# EAGLE design easyMySens-v030 (EAGLE 7.3.0)
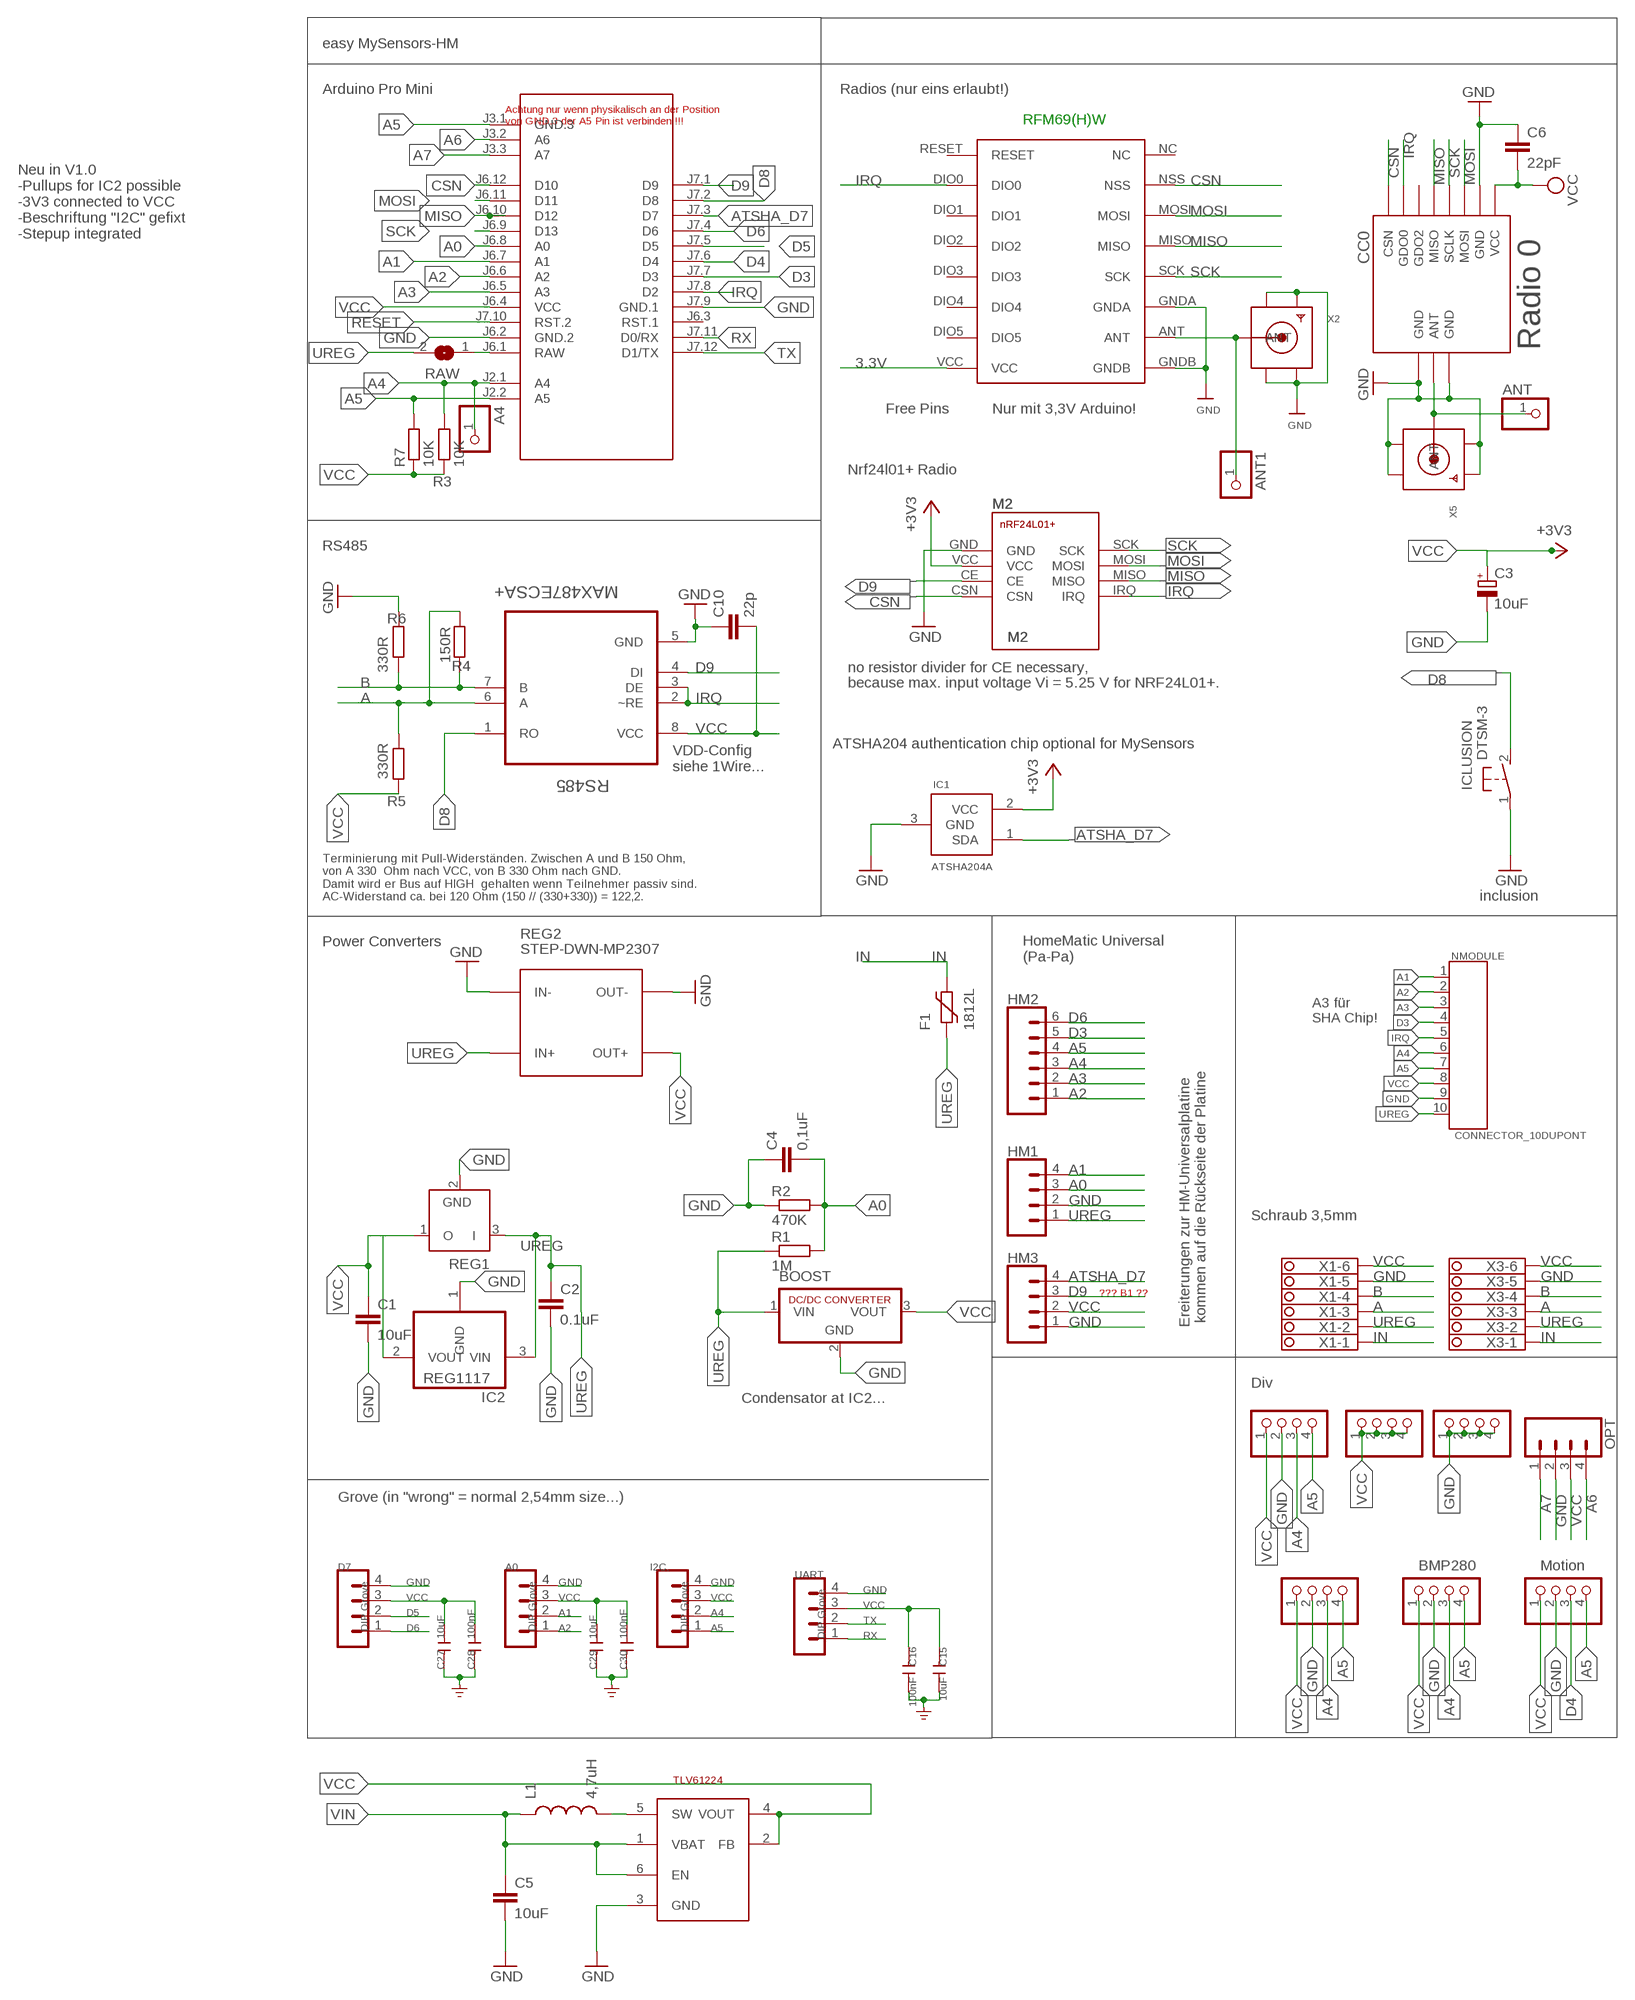
[diagram p0: schematic, sheet 1]

## Parts
A0  DIP Grove  MA04-1  [MA04-1]
A4  PINHD-1X1  [1X01]
ANT  PINHD-1X1  [1X01]
ANT1  PINHD-1X1  [1X01]
BH1750  PINHD-1X04_2.54-S  [1X04-S]
BOOST  R-78C1.8-1.0  [SIP3]
C1  10uF  C-EUC1210  [C1210]
C2  0.1uF  C-EUC1206  [C1206]
C3  10uF  CPOL-EUSMCC  [SMC_C]
C4  0,1uF  C-EUC1206  [C1206]
C5  10uF  CAP0805  [0805]
C6  22pF  C-EUC0805  [C0805]
C10  22p  C-EUC0805  [C0805]
C15  10uF  CAP-0603  [C0603]
C16  100nF  CAP-0603  [C0603]
C27  10uF  CAP-0603  [C0603]
C28  100nF  CAP-0603  [C0603]
C29  10uF  CAP-0603  [C0603]
C30  100nF  CAP-0603  [C0603]
CC0  CC1101  CC1101_MODULE1SMD  [CC1101_MODULE1_SMD]
D7  DIP Grove  MA04-1  [MA04-1]
F1  1812L  [1812L]
HM1  CONN_04  [1X04]
HM2  CONN_06SILK_FEMALE_PTH  [1X06]
HM3  CONN_04  [1X04]
I2C-1  PINHD-1X04_2.54-S  [1X04-S]
I2C-2  PINHD-1X04_2.54-S  [1X04-S]
I2C.  DIP Grove  MA04-1  [MA04-1]
IC1  ATSHA204A  [SOT23]
IC2  REG1117  [SOT223]
ICLUSION  DTSM-3  [DTSM-3]
JP1  PINHD-1X04_2.54-S  [1X04-S]
JP3  PINHD-1X04_2.54-S  [1X04-S]
L1  4,7uH  INDUCTOR0805  [0805]
M1  ARDUINO-PRO-MINI-3.3V#NP  [ARDUINO-PRO-MINI#NP]
M2  NRF24L01+SMD  [NRF24L01+SMD]
MOTION  PINHD-1X04_2.54-S  [1X04-S]
NMODULE  CONNECTOR_10DUPONT  [DUPONT_10]
OPT  CONN_04  [1X04]
R1  1M  R-EU_R0805  [R0805]
R2  470K  R-EU_R0805  [R0805]
R3  10K  R-EU_R0805  [R0805]
R4  150R  R-EU_R0805  [R0805]
R5  330R  R-EU_R0805  [R0805]
R6  330R  R-EU_R0805  [R0805]
R7  10K  R-EU_R0805  [R0805]
RAW  SJ  [SJ]
REG1  LP2950Z  [TO92]
REG2  STEP-DWN-MP2307  DC-DC-STEP-DOWN-MP2307  [DC-DC-STEP-DOWN-MP2307]
RFM69W  RFM69HW  [RFM]
RS485  MAX487ECSA+  [SOIC127P600X175-8N]
STEPUP  TLV61224  TI-TLV61224  [SOT23-6L]
UART  DIP Grove  MA04-1  [MA04-1]
X1  1751280  [1751280]
X2  SMACONNECTOR_EDGE  [SMA_EDGELAUNCH]
X3  1751280  [1751280]
X5  SMACONNECTOR_EDGE  [SMA_EDGELAUNCH]

## Nets
3.3V [Power]: IC1.2(VCC) M2.VCC RFM69W.VCC ; supply symbol labelled +3V3
A: R4.1 R5.2 RS485.6(A) X1.3 X3.3
A0: C4.2 HM1.3 M1.J6.8(A0) R1.2 R2.2
A1: A0.2 HM1.4 M1.J6.7(A1) NMODULE.1
A2: A0.1 HM2.1 M1.J6.6(A2) NMODULE.2
A3: HM2.2 M1.J6.5(A3) NMODULE.3
A4: A4.1 BH1750.3 HM2.3 I2C-1.3 I2C-2.3 I2C..2 M1.J2.1(A4) NMODULE.6 R3.2
A5: BH1750.4 HM2.4 I2C-1.4 I2C-2.4 I2C..1 M1.J2.2(A5) M1.J3.1(GND.3) MOTION.4 NMODULE.7 R7.2
A6: M1.J3.2(A6) OPT.4
A7: M1.J3.3(A7) OPT.1
ANT0: ANT.1 CC0.ANT X5.P(ANT)
ATSHA_D7: HM3.4 IC1.1(SDA) M1.J7.3(D7)
B: R4.2 R6.1 RS485.7(B) X1.4 X3.4
CSN: CC0.CSN M1.J6.12(D10) M2.CSN RFM69W.NSS
D3: HM2.5 M1.J7.7(D3) NMODULE.4
D4: M1.J7.6(D4) MOTION.3
D5: D7.2 M1.J7.5(D5)
D6: D7.1 HM2.6 M1.J7.4(D6)
D8: ICLUSION.2 M1.J7.2(D8) RS485.1(RO)
D9: HM3.3 M1.J7.1(D9) M2.CE RS485.4(DI)
GND [Power]: A0.4 BH1750.2 BOOST.2(GND) C1.2 C2.2 C3.- C4.1 C5.2 C6.1 C10.1 C15.1 C16.1 C27.2 C28.2 C29.2 C30.2 CC0.GND@0(GND) CC0.GND@1(GND) CC0.GND@2(GND) D7.4 HM1.2 HM3.1 I2C-1.2 I2C-2.2 I2C..4 IC1.3(GND) IC2.1(GND) ICLUSION.1 JP1.1 JP1.2 JP1.3 JP1.4 M1.J6.2(GND.2) M1.J7.9(GND.1) M2.GND MOTION.2 NMODULE.9 OPT.2 R2.1 R6.2 REG1.2(GND) REG2.IN- REG2.OUT- RFM69W.GNDA RFM69W.GNDB RS485.5(GND) STEPUP.3(GND) UART.4 X1.5 X2.GND@1(GND4) X2.GND@2(GND3) X2.GND@3(GND2) X2.GND@4(GND1) X3.5 X5.GND@1(GND4) X5.GND@2(GND3) X5.GND@3(GND2) X5.GND@4(GND1) ; supply symbol labelled GND_POWER
IN [Power]: F1.P$2 X1.1 X3.1
IRQ: CC0.GDO0 M1.J7.8(D2) M2.IRQ NMODULE.5 RFM69W.DIO0 RS485.2(~RE) RS485.3(DE)
MISO: CC0.MISO M1.J6.10(D12) M2.MISO RFM69W.MISO
MOSI: CC0.MOSI M1.J6.11(D11) M2.MOSI RFM69W.MOSI
N$13: L1.2 STEPUP.5(SW)
N$16: ANT1.1 RFM69W.ANT X2.P(ANT)
RAW [Power]: M1.J6.1(RAW) RAW.1
RESET: M1.J7.10(RST.2)
RX: M1.J7.11(D0/RX) UART.1
SCK: CC0.SCLK M1.J6.9(D13) M2.SCK RFM69W.SCK
TX: M1.J7.12(D1/TX) UART.2
UREG [Power]: BOOST.1(VIN) C2.1 F1.P$1 HM1.1 IC2.3(VIN) NMODULE.10 R1.1 RAW.2 REG1.3(I) REG2.IN+ X1.2 X3.2
VCC [Power]: A0.3 BH1750.1 BOOST.3(VOUT) C1.1 C3.+ C6.2 C10.2 C15.2 C16.2 C27.1 C28.1 C29.1 C30.1 CC0.VCC D7.3 HM3.2 I2C-1.1 I2C-2.1 I2C..3 IC2.2(VOUT) JP3.1 JP3.2 JP3.3 JP3.4 M1.J6.4(VCC) MOTION.1 NMODULE.8 OPT.3 R3.1 R5.1 R7.1 REG1.1(O) REG2.OUT+ RS485.8(VCC) STEPUP.2(FB) STEPUP.4(VOUT) UART.3 X1.6 X3.6 ; supply symbol labelled +3V3
VIN: C5.1 L1.1 STEPUP.1(VBAT) STEPUP.6(EN)
Unconnected: CC0.GDO2 M1.J6.3(RST.1) RFM69W.DIO1 RFM69W.DIO2 RFM69W.DIO3 RFM69W.DIO4 RFM69W.DIO5 RFM69W.NC RFM69W.RESET

## Notes on the sheet
- easy MySensors-HM
- Arduino Pro Mini | Radios (nur eins erlaubt!)
- Achtung nur wenn physikalisch an der Position 
  von GND.3 der A5 Pin ist verbinden !!!
- RFM69(H)W
- Neu in V1.0
  -Pullups for IC2 possible
  -3V3 connected to VCC
  -Beschriftung "I2C" gefixt
  -Stepup integrated
- Radio 0
- Free Pins | Nur mit 3,3V Arduino!
- Nrf24l01+ Radio
- RS485
- no resistor divider for CE necessary,
- because max. input voltage Vi = 5.25 V for NRF24L01+.
- ATSHA204 authentication chip optional for MySensors
- VDD-Config
  siehe 1Wire...
- Terminierung mit Pull-Widerständen. Zwischen A und B 150 Ohm,
  von A 330  Ohm nach VCC, von B 330 Ohm nach GND. 
  Damit wird er Bus auf HIGH  gehalten wenn Teilnehmer passiv sind.
  AC-Widerstand ca. bei 120 Ohm (150 // (330+330)) = 122,2.
- inclusion
- Power Converters
- HomeMatic Universal
  (Pa-Pa)
- A3 für 
  SHA Chip!
- Schraub 3,5mm
- ??? B1 ??
- Ereiterungen zur HM-Universalplatine
   kommen auf die Rückseite der Platine
- Div
- Condensator at IC2...
- Grove (in "wrong" = normal 2,54mm size...)
- BMP280 | Motion

## Library data of the parts
A0 D7 I2C. UART = con-lstb:MA04-1: PIN HEADER; OC_FARNELL: unknown; OC_NEWARK: unknown
A4 ANT ANT1 = pinhead:PINHD-1X1: PIN HEADER
BH1750 I2C-1 I2C-2 JP1 JP3 MOTION = pinhead-2:PINHD-1X04: PIN HEADER
BOOST = dc-dc-converter:R-78C*-1.0: INNOLINE DC/DC-Converter 1.0 AMP SIP3 Single Output Source: Data sheet <http://www.mikrocontroller.net/attachment/150645/157764-da-01-en-DC_DC_WANDLER_R_78C5_0_1_0.pdf>
C1 C2 C4 C6 C10 = rcl:C-EU: CAPACITOR, European symbol
C3 = rcl:CPOL-EU: POLARIZED CAPACITOR, European symbol
C5 = SparkFun-Passives:CAP: Capacitor Standard 0603 ceramic capacitor, and 0.1" leaded capacitor.
C15 C16 C27-C30 = Discrete-new:CAP: Ceramic Capacitors
CC0 = wireless:CC1101_MODULE1: CC1101 wireless module for 433/868 MHz (sold from Aliexpress). DIL version for mounting with pin header (and SMD soldering) and SMD only variant available.
F1 = ptc-littlefuse:1812L
HM1 HM3 OPT = SparkFun-Connectors:CONN_04: Multi connection point. Often used as Generic Header-pin footprint for 0.1 inch spaced/style header connections On any of the 0.1 inch spaced packages, you can populate with these: Break Away Headers - Straight <https://www.sparkfun.com/products/116> (PRT-00116) Break Away Male Headers - Right Angle <https://www.sparkfun.com/products/553> (PRT-00553) Female Headers <https://www.sparkfun.com/products/115> (PRT-00115) Break Away Headers - Machine Pin <https://www.sparkfun.com/products/117> (PRT-00117) Break Away Female Headers - Swiss Machine Pin <https://www.sparkfun.com/products/743> (PRT-00743) For SCREWTERMINALS and SPRING TERMINALS visit here: Screw Terimnals on SparkFun.com <https://www.sparkfun.com/search/results?term=Screw+Terminals> (5mm/3.5mm/2.54mm spacing) This device is also useful as a general connection point to wire up your design to another part of your project. Our various solder wires solder well into these plated through hole pads. Hook-Up Wire - Assortment (Stranded, 22 AWG) <https://www.sparkfun.com/products/11375> (PRT-11375) Hook-Up Wire - Assortment (Solid Core, 22 AWG) <https://www.sparkfun.com/products/11367> (PRT-11367) View the entire wire category on our website here <https://www.sparkfun.com/categories/141> Special notes: Molex polarized connector foot print use with SKU : PRT-08231 with associated crimp pins and housings. 1MM SMD Version SKU: PRT-10208; PROD_ID: CONN-09696
HM2 = SparkFun-Connectors:CONN_06: Multi connection point. Often used as Generic Header-pin footprint for 0.1 inch spaced/style header connections On any of the 0.1 inch spaced packages, you can populate with these: Break Away Headers - Straight <https://www.sparkfun.com/products/116> (PRT-00116) Break Away Male Headers - Right Angle <https://www.sparkfun.com/products/553> (PRT-00553) Female Headers <https://www.sparkfun.com/products/115> (PRT-00115) Break Away Headers - Machine Pin <https://www.sparkfun.com/products/117> (PRT-00117) Break Away Female Headers - Swiss Machine Pin <https://www.sparkfun.com/products/743> (PRT-00743) Arduino Stackable Header - 6 Pin <https://www.sparkfun.com/products/9280> (PRT-09280) For SCREWTERMINALS and SPRING TERMINALS visit here: Screw Terimnals on SparkFun.com <https://www.sparkfun.com/search/results?term=Screw+Terminals> (5mm/3.5mm/2.54mm spacing) This device is also useful as a general connection point to wire up your design to another part of your project. Our various solder wires solder well into these plated through hole pads. Hook-Up Wire - Assortment (Stranded, 22 AWG) <https://www.sparkfun.com/products/11375> (PRT-11375) Hook-Up Wire - Assortment (Solid Core, 22 AWG) <https://www.sparkfun.com/products/11367> (PRT-11367) View the entire wire category on our website here <https://www.sparkfun.com/categories/141>; PROD_ID: CONN-08437
IC1 = Sensor:ATSHA204A
IC2 = burr-brown:REG1117: 800mA and 1A Low Dropout (LDO) Positive Regulator 1.8V, 2.5V, 2.85V, 3.3V, 5V, and Adj; MPN: REG1117; OC_FARNELL: 1097566; OC_NEWARK: 14P6981
ICLUSION = mechanics:DTSM-3: Diptronics SMD button 6x3.5 mm
L1 = SparkFun-Passives:INDUCTOR: Inductors Basic Inductor/Choke - 0603 and 1206. Footprints are not proven and vary greatly between part numbers.
M1 = diy-modules:ARDUINO-PRO-MINI-*#NP: Arduino Pro Mini without programming pads
M2 = wireless:NRF24L01+: nRF24L01+ Transceiver Module
NMODULE = TD-MySensors:CONNECTOR_10
R1-R7 = rcl:R-EU_: RESISTOR, European symbol
RAW = jumper:SJ: SMD solder JUMPER
REG1 = linear:LP2950: 100 mA, Low Power Low Dropout Voltage Regulator Source: http://www.onsemi.com/pub/Collateral/LP2950-D.PDF
REG2 = diy-modules:DC-DC-STEP-DOWN-MP2307: DC/DC Step-Down Regulator based on MP2307DN chip MP2307 datasheet available here: https://cdn-shop.adafruit.com/datasheets/MP2307_r1.9.pdf Click here to find device on ebay.com <http://www.ebay.com/sch/dc+dc+3a+mini+converter>
RFM69W = hoperf:RFM69HW
RS485 = Maxim_By_element14_Batch_1:MAX487ECSA+: Low-Power, Slew-Rate-Limited RS-485/RS-422 Transceivers; MPN: MAX487ECSA+; OC_FARNELL: 9724532; OC_NEWARK: 68K4803; PACKAGE: SOIC-8; SUPPLIER: Maxim
STEPUP = TLV61224:TI-TLV61224
X1 X3 = con-phoenix-350:1751280: MKDS 1/ 6-3,5 Printklemme Nennstrom: 10 A Bemessungsspannung: 160 V Raster: 3,5 mm Polzahl: 6 Montageart: Löten Anschlussart: Schraubanschluss Anschlussrichtung vom Leiter zur Platine: 0° Source: http://eshop.phoenixcontact.com .. 1751280.pdf; MPN: 1751280; OC_FARNELL: unknown; OC_NEWARK: 27R1765
X2 X5 = adafruit:SMACONNECTOR: SMA Connector 90° DIP SMA Connector, 50 Ohm (4UConnector: 07259)

## Net classes
0 default: width 0.305 mm
1 Power: width 0.508 mm

## Board
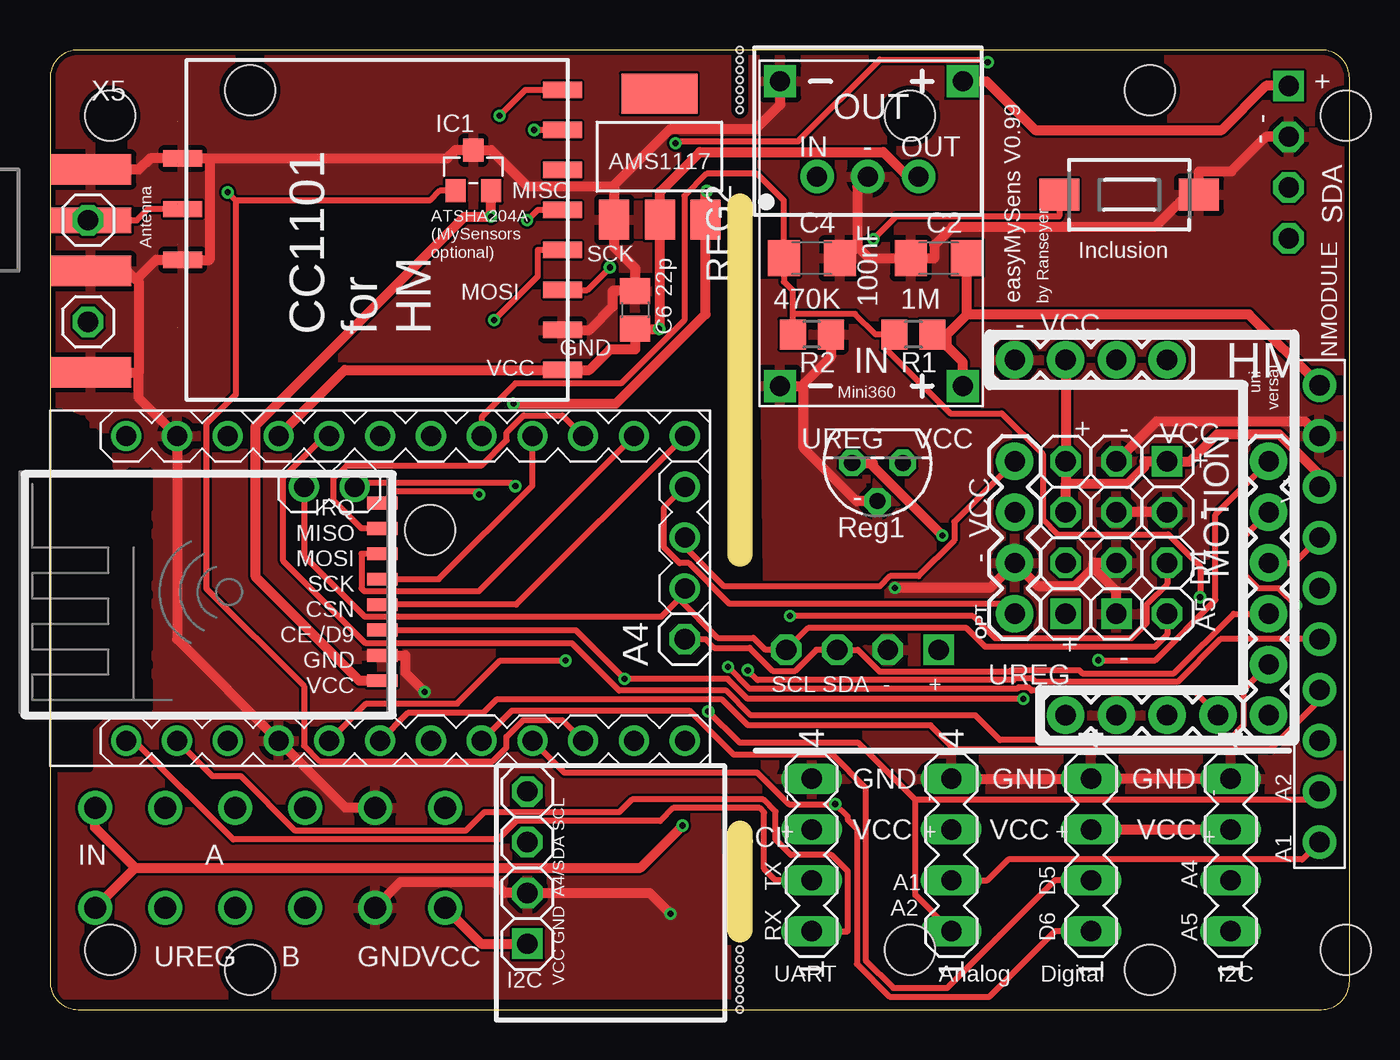
[diagram p1: board, top side]
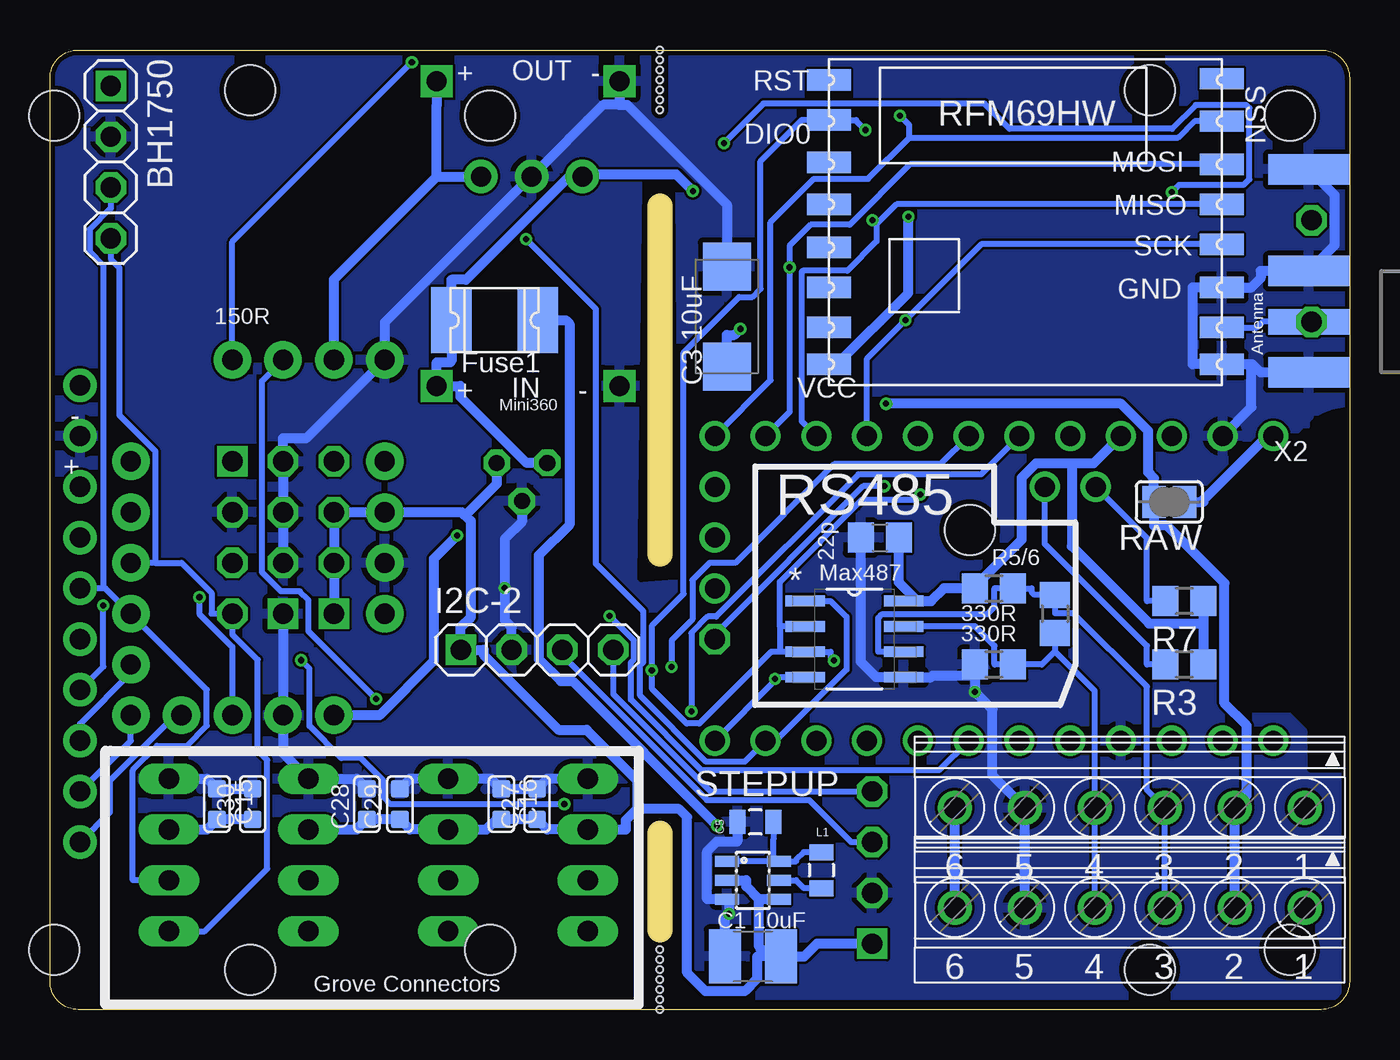
[diagram p2: board, bottom side, seen from below]

Size 65 x 48 mm. Coordinates in mm from the lower left corner, seen from the top.
Outline: 0,46.59 0,1.41 arc90 1.41,0 63.59,0 arc90 65,1.41 65,46.59 arc90 63.59,48 1.41,48 arc90 0,46.59
Copper layers (1*16): Top 0.035mm / dielectric 1.5mm / Bottom 0.035mm
Design rules "dirt_cheap_dirty_boards.v1": minimum track width 5mil, minimum drill 12mil, track to track 5mil, track to pad 5mil, pad to pad 5mil, via to via 5mil, smd to smd 0mil, copper to edge 10mil, drill to drill 10mil, minimum pad ring 10mil, minimum via ring 6mil, stop-mask expansion 2mil, vias tented up to drill 25mil, thermal gap 10mil
Holes 2.5 mm at 19,24 3,3 3,44.7 64.8,44.7 43,3 64.8,3 43,44.7 10,2 55,2 10,46 55,46
Holes 0.3 mm at 34.5,3 34.5,2.5 34.5,2 34.5,1.5 34.5,1 34.5,0.5 34.5,45 34.5,45.5 34.5,46 34.5,46.5 34.5,47 34.5,47.5 34.5,48 34.5,0
tRestrict: area 33.8,21.6 to 35.4,41.4; area 33.8,3.3 to 35.3,9.6; 18 lines
bRestrict: area 33.8,21.6 to 35.4,41.3; area 33.8,3.3 to 35.4,9.5; 17 lines
Milling: 2 lines

### Footprints (pad centres in the part's own frame; a part is rotated, then mirrored left to right if it is on the bottom)
MA04-1 = drill 1.016 long: 1 -3.81,0; 2 -1.27,0; 3 1.27,0; 4 3.81,0
1X01 = drill 1.016 octagon: 1 0,0
1X04-S = drill 1.016 square: 1 -3.81,0 | drill 1.016 octagon: 2 -1.27,0; 3 1.27,0; 4 3.81,0
SIP3 = drill 1 pad 1.676: 1 -2.54,0; 2 0,0; 3 2.54,0
C1210 = smd 1.6 x 2.7: 1 -1.4,0; 2 1.4,0
C1206 = smd 1.6 x 1.8: 1 -1.4,0; 2 1.4,0
SMC_C = smd 2.4 x 2.4: + -2.5,0; - 2.5,0
0805 = smd 0.8 x 1.2: 1 -0.9,0; 2 0.9,0
C0805 = smd 1.3 x 1.5: 1 -0.95,0; 2 0.95,0
C0603 = smd 0.889 x 0.889: 1 0,0.762; 2 0,-0.762
CC1101_MODULE1_SMD = smd 1.93 x 0.813: ANT 19,5.96; CSN 0,0; GDO0 0,2; GDO2 0,4; GND@0 0,12; GND@1 19,8.5; GND@2 19,3.42; MISO 0,6; MOSI 0,10; SCLK 0,8; VCC 0,14
1812L = smd 2.03 x 3.3: P$1 -2.16,0; P$2 2.16,0
1X04 = drill 1.016 pad 1.88: 1 0,0; 2 2.54,0; 3 5.08,0; 4 7.62,0
1X06 = drill 1.016 pad 1.88: 1 0,0; 2 2.54,0; 3 5.08,0; 4 7.62,0; 5 10.16,0; 6 12.7,0
SOT23 = smd 1.016 x 1.143: 1 -0.889,-1.016; 2 0.889,-1.016; 3 0,1.016
SOT223 = smd 1.499 x 2.007: 1 -2.261,-3.15; 2 0.025,-3.15; 3 2.311,-3.15 | smd 3.81 x 2.007: 4 0,3.15
DTSM-3 = smd 2 x 1.6: 1 -3.494,0; 2 3.494,0
ARDUINO-PRO-MINI#NP = drill 1: J2.1 -1.27,5.08; J2.2 -3.81,5.08; J3.1 15.24,0; J3.2 15.24,2.54; J3.3 15.24,5.08; J6.1 -12.7,7.62; J6.2 -10.16,7.62; J6.3 -7.62,7.62; J6.4 -5.08,7.62; J6.5 -2.54,7.62; J6.6 0,7.62; J6.7 2.54,7.62; J6.8 5.08,7.62; J6.9 7.62,7.62; J6.10 10.16,7.62; J6.11 12.7,7.62; J6.12 15.24,7.62; J7.1 15.24,-7.62; J7.2 12.7,-7.62; J7.3 10.16,-7.62; J7.4 7.62,-7.62; J7.5 5.08,-7.62; J7.6 2.54,-7.62; J7.7 0,-7.62; J7.8 -2.54,-7.62; J7.9 -5.08,-7.62; J7.10 -7.62,-7.62; J7.11 -10.16,-7.62; J7.12 -12.7,-7.62
NRF24L01+SMD = smd 0.635 x 1.524: CE -1.575,-7.861; CSN -0.305,-7.861; GND -2.845,-7.861; IRQ 4.775,-7.861; MISO 3.505,-7.861; MOSI 2.235,-7.861; SCK 0.965,-7.861; VCC -4.115,-7.861
DUPONT_10 = drill 1.016 pad 1.676: 1 1.27,1.27; 2 3.81,1.27; 3 6.35,1.27; 4 8.89,1.27; 5 11.43,1.27; 6 13.97,1.27; 7 16.51,1.27; 8 19.05,1.27; 9 21.59,1.27; 10 24.13,1.27
R0805 = smd 1.3 x 1.5: 1 -0.95,0; 2 0.95,0
SJ = smd 1.168 x 1.6: 1 -0.762,0; 2 0.762,0
TO92 = drill 0.813 octagon: 1 -1.27,0; 2 0,1.905; 3 1.27,0
DC-DC-STEP-DOWN-MP2307 = drill 1 pad 1.6 square: IN+ -7.62,-4.572; IN- -7.62,4.572; OUT+ 7.62,-4.572; OUT- 7.62,4.572
RFM = smd 2.184 x 1.067: ANT 19.651,2.889; DIO0 0,13.27; DIO1 0,11.143; DIO2 0,9.047; DIO3 0,6.889; DIO4 0,4.889; DIO5 0,2.889; GNDA 19.651,4.889; GNDB 19.651,1.048; MISO 19.651,9.047; MOSI 19.651,11.047; NC 19.651,15.334; NSS 19.651,13.206; RESET 0,15.27; SCK 19.651,7.048; VCC 0,1.048
SOIC127P600X175-8N = smd 1.981 x 0.533: 1 -2.464,1.905; 2 -2.464,0.635; 3 -2.464,-0.635; 4 -2.464,-1.905; 5 2.464,-1.905; 6 2.464,-0.635; 7 2.464,0.635; 8 2.464,1.905
SOT23-6L = smd 0.55 x 1.2: 1 -0.95,-1.3; 2 0,-1.3; 3 0.95,-1.3; 4 0.95,1.3; 5 0,1.3; 6 -0.95,1.3
1751280 = drill 1.1 pad 1.7: 1 -8.75,-0.1; 2 -5.25,-0.1; 3 -1.75,-0.1; 4 1.75,-0.1; 5 5.25,-0.1; 6 8.75,-0.1
SMA_EDGELAUNCH = smd 4.064 x 1.524: GND@1 2.032,-2.54; GND@2 2.032,2.54 | smd 4.064 x 1.524 bottom: GND@3 2.032,2.54; GND@4 2.032,-2.54 | smd 4.064 x 1.27: P 2.032,0

### Placement (x,y rotation side)
A0  45.09,7.73 90 top
A4  31.75,18.53 90 top
ANT  1.91,39.48 0 top
ANT1  1.91,34.41 0 top
BH1750  61.96,42.39 270 bottom
BOOST  40.91,41.67 0 top
C1  29.84,2.66 180 bottom
C2  44.45,37.58 180 top
C3  31.14,34.67 90 bottom
C4  38.1,37.58 180 top
C5  29.72,9.39 180 bottom
C6  29.27,35 270 top
C10  23.5,23.61 0 bottom
C15  56.64,10.27 0 bottom
C16  42.42,10.27 0 bottom
C27  40.64,10.27 180 bottom
C28  49.15,10.27 180 bottom
C29  47.5,10.27 180 bottom
C30  54.86,10.27 180 bottom
CC0  25.64,46 180 top
D7  52.07,7.73 90 top
F1  42.76,34.48 0 bottom
HM1  50.8,14.72 0 top
HM2  60.96,14.72 90 top
HM3  48.26,32.5 0 top
I2C-1  23.88,7.1 90 top
I2C-2  40.64,17.99 0 bottom
I2C.  59.05,7.73 90 top
IC1  21.18,41.97 0 top
IC2  30.48,42.66 0 top
ICLUSION  53.98,40.75 180 top
JP1  53.34,23.61 90 top
JP3  50.8,23.61 90 top
L1  26.42,6.97 270 bottom
M1  16.51,21.07 0 top
M2  8.76,20.56 90 top
MOTION  55.88,23.61 270 top
NMODULE  64.77,7.1 90 top
OPT  48.26,19.8 90 top
R1  43.18,33.77 180 top
R2  38.1,33.77 180 top
R3  8.26,17.26 180 bottom
R4  14.73,19.8 270 bottom
R5  17.78,21.07 0 bottom
R6  17.78,17.26 180 bottom
R7  8.26,20.44 180 bottom
RAW  9.02,25.39 180 bottom
REG1  41.39,27.34 180 top
REG2  41.09,38.81 90 top
RFM69W  26.04,31.23 0 bottom
RS485  24.77,18.53 0 bottom
STEPUP  29.84,6.47 270 bottom
UART  38.1,7.73 90 top
X1  11,10 180 bottom
X2  0,34.41 180 bottom
X3  11,5 180 bottom
X5  0,39.48 0 top

### Tracks (layer width: path | path; a pad name or v marks a point on that pad's centre or on a via)
3.3V  (via drill 0.3 pad 0.61)
  Top 0.508: M2.VCC 15.48,16.45 10.29,21.64 10.29,29.22 20.73,39.66 v22.06,39.66 IC1.2
  Bottom 0.508: RFM69W.VCC 25.63,32.28 22.06,35.84 v22.06,39.66
A
  Bottom 0.305: X3.3 X1.3 10.13,10.98 10.13,16.15 13.8,19.82 14.73,19.82 R4.1 15.76,20.75 15.9,20.89 15.9,21.07 R5.2 17.76,21.07 17.76,20.14 18.12,19.78 23.39,19.78 23.57,19.59 23.57,17.9 RS485.6
A0  (via drill 0.3 pad 0.61)
  Top 0.305: 41.77,33.77 41.77,33.09 45.03,29.82 47.61,29.82 49.65,27.78 49.65,24.53 50.42,23.76 55.93,23.76 57.53,22.17 v57.53,20.63 | 41.77,33.77 41.3,33.77 40.27,34.8 37.15,34.8 | R1.2 41.77,33.77 | 37.15,34.8 37.15,35.95 36.7,36.4 C4.2 36.7,40.47 35.36,41.8 32.84,41.8 31.73,40.69 31.73,34.49 28.56,31.31 23.28,31.31 21.59,29.63 M1.J6.8 | R2.2 37.15,34.8
  Bottom 0.305: v57.53,20.63 57.53,19.79 55.88,18.15 HM1.3
A1  (via drill 0.3 pad 0.61)
  Top 0.305: HM1.4 57.18,15.96 49.1,15.96 48.94,16.12 48.45,16.12 48.38,16.05 35,16.05 v33.91,17.13 | A0.2 46.89,6.47 47.93,7.51 62.64,7.51 NMODULE.1
  Bottom 0.305: NMODULE.1 61.99,9.88 61.99,11.47 58.74,14.72 HM1.4 | M1.J6.7 20.46,27.28 25.78,27.28 30.72,22.34 32.01,22.34 32.87,21.48 32.87,19.5 33.91,18.46 v33.91,17.13
A2  (via drill 0.3 pad 0.61)
  Top 0.305: v32.92,14.92 34.49,13.35 40.4,13.35 43.28,10.48 | NMODULE.2 63.07,10.48 43.28,10.48 | A0.1 43.28,5.73 43.28,10.48
  Bottom 0.305: M1.J6.6 18.43,26.77 24.57,26.77 31.69,19.65 32.1,19.65 32.92,18.83 v32.92,14.92 | NMODULE.2 60.96,13.45 HM2.1
A3
  Top 0.305: HM2.2 59.69,15.99 59.69,14.2 58.98,13.49 47.52,13.49 46.28,14.72 35.04,14.72 33.81,15.95 28.47,15.95 26.11,18.31 15.79,18.31 11.66,22.44 11.66,26.62 13.73,28.69 M1.J6.5
  Bottom 0.305: NMODULE.3 63.5,14.29 60.96,16.83 HM2.2
A4  (via drill 0.3 pad 0.61)
  Top 0.305: HM2.3 59.2,19.8 56.22,16.82 51.63,16.82 51.47,16.99 48.09,16.99 48.02,16.91 41.49,16.91 40.41,17.99 I2C-2.3 38.33,17.99 37.28,16.94 36.15,16.94 34.99,18.1 33.22,18.1 32.79,18.53 A4.1 | M1.J2.1 15.44,26.35 23.11,26.35 v23.28,26.18
  Bottom 0.305: v23.28,26.18 24.33,26.18 31.75,18.76 A4.1 | BH1750.3 61.96,40.08 63.02,39.02 63.02,37.93 62.33,37.24 62.33,21.07 | I2C..2 60.86,6.47 60.86,11.98 59.64,13.2 58.16,13.2 57.15,14.2 57.15,15.99 HM2.3 62.23,21.07 62.33,21.07 | R3.2 10.13,17.26 10.13,18.19 15.24,23.3 M1.J2.1 | I2C-1.3 24.92,8.37 27.03,10.48 32.14,10.48 39.37,17.71 I2C-2.3 | 62.33,21.07 NMODULE.6
A5
  Top 0.305: HM2.4 62.23,22.34 NMODULE.7 | 31.45,20.54 33.39,18.6 35.18,18.6 35.79,17.99 I2C-2.4 37.92,19.08 45.84,19.08 46.78,18.14 55.26,18.14 55.88,18.76 MOTION.4 | M1.J2.2 12.7,22.7 15.74,19.66 30.58,19.66 31.45,20.54 | 31.45,20.54 31.45,20.77 M1.J3.1
  Bottom 0.305: 59.73,22.34 58.41,22.34 56.92,20.85 56.92,19.8 MOTION.4 55.88,18.76 54.61,17.49 54.61,12.96 54.13,12.48 54.13,7.05 57.25,3.92 I2C..1 | BH1750.4 61.96,37.54 61.53,37.11 61.53,29.73 59.73,27.93 59.73,22.34 | R7.2 10.13,20.44 10.13,23.58 M1.J2.2 | 59.73,22.34 HM2.4 | I2C-2.4 36.83,15.78 31.96,10.91 I2C-1.4
A6
  Top 0.305: OPT.4 45.23,24.39 45.23,23.47 43.44,21.68 42.01,21.68 41.51,21.17 33.72,21.17 31.75,23.15 M1.J3.2
A7
  Top 0.305: OPT.1 47.77,20.3 33.99,20.3 31.95,22.33 31.5,22.33 30.71,23.11 30.71,25.11 M1.J3.3
ANT0
  Top 0.305: ANT.1 X5.P 4.34,39.48 4.9,40.04 CC0.ANT
ATSHA_D7  (via drill 0.3 pad 0.61)
  Top 0.305: v31.29,43.34 31.37,43.43 37.42,43.43 41.51,47.52 46.77,47.52 v46.9,47.39 | 9.3,40.47 v8.89,40.88 | 9.3,40.47 19.01,40.47 19.5,40.96 IC1.1 | 9.3,40.47 9.3,30.76 7.82,29.28 7.82,21.06 12.7,16.18 12.7,13.21 13.5,12.41 22.14,12.41 22.83,13.11 22.83,13.64 23.68,14.48 25.64,14.48 M1.J7.3
  Bottom 0.305: v8.89,40.88 8.51,41.25 5.29,41.25 5.01,41.53 5.01,45.09 5.17,45.25 7.69,45.25 8.89,44.06 17,44.06 18.26,45.31 29.31,45.31 v31.29,43.34 | HM3.4 55.88,38.41 v46.9,47.39
B
  Bottom 0.305: RS485.7 18.73,19.16 17.76,18.19 17.76,17.26 R6.1 15.39,17.26 14.73,17.92 | R4.2 14.73,17.92 | 14.73,17.92 12.75,15.94 X1.4 X3.4
CSN  (via drill 0.3 pad 0.61)  (1 unrouted)
  Top 0.305: CC0.CSN 23.77,46 v22.48,44.71 | M1.J6.12 23.32,20.26 M2.CSN
  Bottom 0.305: 22.02,43.62 22.02,44.24 v22.48,44.71 | 22.02,43.62 8.57,43.62 7.75,44.44 RFM69W.NSS | M1.J6.12 28.96,31.48 28.96,39.39 26.79,41.56 24.08,41.56 22.02,43.62
D3  (via drill 0.3 pad 0.61)
  Top 0.305: NMODULE.4 63.5,15.48 61.03,13.01 45.24,13.01 44.04,14.22 34.91,14.22 33.62,15.51 22.33,15.51 21.65,14.83 17.89,14.83 M1.J7.7 | v62.33,20.21 61.47,21.07 60.43,21.07 59.74,21.77 59.74,23.66 HM2.5
  Bottom 0.305: NMODULE.4 62.33,17.16 v62.33,20.21
D4  (via drill 0.3 pad 0.61)
  Top 0.305: MOTION.3 55.88,21.3 54.84,20.26 54.84,19.32 54.09,18.58 47.26,18.58 46.15,19.69 v37.01,19.69
  Bottom 0.305: M1.J7.6 20.53,11.97 32.4,11.97 35.95,15.51 35.95,17.36 35.79,17.52 35.79,18.46 v37.01,19.69
D5
  Top 0.305: D7.2 50.27,6.47 44.88,1.08 42.18,1.08 40.79,2.47 40.79,11.09 39.13,12.76 34.19,12.76 31.99,14.96 23.1,14.96 M1.J7.5
D6  (via drill 0.3 pad 0.61)
  Top 0.305: v52.44,17.47 55.28,17.47 58.29,20.49 58.29,24.75 HM2.6 | M1.J7.4 25.72,11.86 35.37,11.86 36.96,10.27 v39.27,10.27 39.89,9.66 39.89,9.52 40.36,9.05 40.36,2.29 42,0.65 46.99,0.65 50.27,3.92 D7.1
  Bottom 0.305: v39.27,10.27 47.98,10.27 48.32,10.62 48.32,11.44 49.47,12.59 50.42,12.59 52.02,14.18 52.02,17.06 v52.44,17.47
D8  (via drill 0.3 pad 0.61)
  Top 0.305: v41.19,38.54 42.33,39.67 50.48,39.67 ICLUSION.2
  Bottom 0.305: v41.19,38.54 37.69,35.04 37.69,22.29 35.32,19.92 35.32,17.38 35.48,17.22 35.48,15.7 32.18,12.4 30.26,12.4 M1.J7.2 28.72,13.45 25.16,17.01 25.16,19.64 25.96,20.44 RS485.1
D9  (via drill 0.3 pad 0.61)
  Top 0.305: v48.7,15.54 34.9,15.54 33.9,16.54 v28.74,16.54 26.29,18.99 17.67,18.99 M2.CE
  Bottom 0.305: RS485.4 28.5,16.62 28.58,16.54 v28.74,16.54 28.74,16.46 M1.J7.1 | v48.7,15.54 52.07,18.91 52.07,20.49 52.5,20.92 53.44,20.92 54.4,21.87 54.4,31.44 HM3.3
GND  (via drill 0.3 pad 0.61)
  Top 0.508: 28.22,41.19 IC2.1 28.22,38.13 29.27,37.08 C6.1 28.14,35.95 28.14,35.16 26.98,34 CC0.GND@0 | 28.22,41.19 28.22,41.24 31.01,44.03 35.29,44.03 36.51,45.25 REG2.OUT- | 28.22,41.19 23.87,41.19 22.06,42.99 IC1.3 20.29,42.99 19.88,42.58 7.98,42.58 | 7.98,42.58 7.98,37.5 CC0.GND@1 5.29,37.5 4.31,36.52 | v42.26,21.09 47.02,21.09 OPT.2 49.41,21.19 51.29,21.19 52.19,22.09 | 57.47,41.35 55.27,39.14 45.13,39.14 44.23,38.24 44.23,37.58 C2.2 40.96,37.58 40.38,38.17 | 57.47,41.35 57.47,41.94 59.09,41.94 60.82,43.66 BH1750.2 | ICLUSION.1 57.47,41.35 | 40.38,38.17 39.79,37.58 C4.1 | BOOST.2 40.38,41.14 40.38,38.17 | X3.5 17.54,6.39 22.18,6.39 22.73,5.83 I2C-1.2 30,5.83 v31.04,4.78 | v18.73,15.89 17.77,16.85 17.77,17.72 M2.GND | 4.31,36.52 4.29,36.52 3.86,36.94 X5.GND@4 | 4.31,36.52 4.45,36.38 4.45,31.87 | 4.45,31.87 4.45,30.59 M1.J6.2 6.35,18.53 M1.J7.9 14.78,10.1 X1.5 | X2.GND@3 4.45,31.87 | REG1.2 40.35,25.44 37.69,28.09 37.69,31.2 | 52.19,22.09 52.2,22.1 52.2,22.34 JP1.2 | 52.19,22.09 53.34,20.94 JP1.1 | 7.98,42.58 CC0.GND@2 5,42.58 4.45,42.03 X5.GND@3 | REG2.IN- 37.69,31.2 | R2.1 39.05,32.64 37.69,31.28 37.69,31.2 | MOTION.2 JP1.3 | A0.4 D7.4 I2C..4 | JP1.4 55.35,29.43 62.76,29.43 NMODULE.9
  Bottom 0.508: REG1.2 41.39,24.39 42.26,23.53 v42.26,21.09 42.26,19.48 41.91,19.13 I2C-2.2 | UART.4 40.01,11.55 40.13,11.55 C27.2 C16.1 42.93,11.55 A0.4 46.99,11.55 | 18.73,16.69 20.86,16.69 20.93,16.62 RS485.5 23.67,16.62 24.45,17.4 C10.1 | 18.73,16.69 18.73,16.13 v18.73,15.89 17.86,15.02 17.86,11.71 X1.5 X3.5 | R6.2 18.73,16.69 | X5.GND@3 0.76,40.75 0.76,38.22 X5.GND@4 4.45,36.94 4.45,36.58 4.91,36.12 RFM69W.GNDA 7.86,36.12 7.86,32.28 RFM69W.GNDB 4.91,32.28 | C28.2 49.66,11.55 D7.4 53.34,12.81 HM1.2 JP1.1 | 46.99,11.55 | 46.99,11.55 C29.2 | 36.51,45.25 36.13,45.25 31.14,40.27 C3.- | 36.51,45.25 36.51,45.71 REG2.OUT- | 36.51,45.25 37.33,45.25 BOOST.2 40.96,41.67 48.26,34.37 HM3.1 52.2,28.56 53.34,28.56 JP1.4 JP1.3 JP1.2 | C1.2 31.25,4.58 v31.04,4.78 31.04,5.41 STEPUP.3 32.13,5.52 32.13,7.92 31.64,8.41 30.62,8.41 C5.2 | I2C..4 57.15,11.55 | 4.91,32.28 4.86,32.28 4.45,31.87 X2.GND@3 | M1.J6.2 4.91,30.13 4.91,32.28 | 57.15,11.55 | 57.15,11.55 C15.1 C30.2
  pour Bottom: 0.64,0.75 0.64,12.18 3.17,14.72 5.08,14.72 5.08,26.78 3.17,26.78 1.91,29.96 0,29.96 0,46.47 1.27,47.74 64.77,47.74 65.41,0.75
  pour Top: 0.64,0.75 0.64,12.18 3.17,14.72 5.08,14.72 5.08,26.78 3.17,26.78 1.91,29.96 0,29.96 0,46.47 1.27,47.74 64.77,47.74 65.41,0.75
IN  (via drill 0.3 pad 0.61)
  Top 0.508: 4.25,7.1 29.54,7.1 v31.63,9.2 | X3.1 4.25,7.1 | 4.25,7.1 2.25,9.1 X1.1
  Bottom 0.508: F1.P$2 39.2,34.48 39.02,34.3 39.02,24.25 40.55,22.72 40.55,17.53 39.45,16.43 38.86,16.43 v31.63,9.2
IRQ  (via drill 0.3 pad 0.61)
  Top 0.305: v21.47,25.76 21.32,25.92 17.2,25.92 M2.IRQ | NMODULE.5 58.54,18.53 56.4,16.39 49.28,16.39 49.12,16.56 48.27,16.56 48.2,16.48 35.39,16.48 v34.9,16.97 | M1.J7.8 15.82,15.3 20.37,15.3 22.52,17.45 v25.79,17.45 | v24.21,44 24.39,44 CC0.GDO0
  Bottom 0.305: 28.5,19.16 28.5,21.4 24.39,25.51 21.73,25.51 | 21.73,25.51 | 21.73,25.51 v21.47,25.76 | 34.89,16.97 34.89,19.22 33.3,20.8 33.3,32.87 30.53,35.65 29.87,35.65 29.46,36.06 29.46,42.45 27.41,44.5 RFM69W.DIO0 24.66,44.5 24.66,44.45 v24.21,44 | 28.5,17.9 28.93,17.9 32.52,14.3 33.16,14.3 34.89,16.03 34.89,16.97 | 34.89,16.97 v34.9,16.97 | RS485.2 28.5,19.16 | 28.5,19.16 28.5,17.9 | 28.5,17.9 RS485.3 25.96,17.9 25.96,17.62 v25.79,17.45
MISO  (via drill 0.3 pad 0.61)  (1 unrouted)
  Top 0.305: CC0.MISO 24.39,40 23.88,39.49 v23.87,39.49 | M2.MISO 15.58,24.07 14.19,25.46 14.19,26.56 14.85,27.22 21.59,27.22 22.85,28.48 22.85,28.87 23.7,29.72 25.64,29.72 M1.J6.10
  Bottom 0.305: 23.65,39.28 v23.87,39.49 | RFM69W.MISO 22.65,40.28 23.65,39.28 | 23.65,39.28 23.65,38.43 25.12,36.96 27.34,36.96 27.41,36.89 27.41,29.43 M1.J6.10
MOSI  (via drill 0.3 pad 0.61)  (1 unrouted)
  Top 0.305: v28,37.12 26.88,36 CC0.MOSI | M2.MOSI 15.58,22.8 15.58,21.07 15.72,20.93 21.45,20.93 M1.J6.11
  Bottom 0.305: RFM69W.MOSI 21.98,42.28 25,39.26 26.95,39.26 28,38.21 v28,37.12 28,29.9 M1.J6.11
N$13
  Bottom 0.305: STEPUP.5 27.67,6.47 27.67,6.44 27.3,6.07 L1.2
N$16  (1 unrouted)
  Bottom 0.305: ANT1.1 X2.P 4.34,34.41 4.63,34.12 RFM69W.ANT
RAW
  Bottom 0.508: RAW.1 7.29,25.39 7.29,25.51 4.11,28.69 M1.J6.1
RX
  Top 0.305: UART.1 39.9,3.92 39.9,6.92 39.09,7.73 37.07,7.73 36.3,8.51 36.3,9.9 35.68,10.51 29.12,10.51 28.47,9.87 21.72,9.87 20.8,8.95 12.27,8.95 9.55,11.66 8.14,11.66 M1.J7.11
SCK  (via drill 0.3 pad 0.61)  (1 unrouted)
  Top 0.305: M2.SCK 19.45,21.53 24.13,26.21 M1.J6.9 | CC0.SCLK 24.39,38 24.39,36.66 v22.21,34.48
  Bottom 0.305: RFM69W.SCK 18.42,38.28 v22.21,34.48 24.13,32.57 M1.J6.9
TX
  Top 0.305: UART.2 36.3,6.47 35.72,7.04 35.72,9.86 35.5,10.08 31.17,10.08 30.53,9.44 23.34,9.44 22.41,8.51 9.16,8.51 4.22,13.45 M1.J7.12
UREG  (via drill 0.3 pad 0.61)
  Top 0.508: REG2.IN+ 45.66,32.38 44.85,33.18 44.85,33.77 | 45.85,34.77 C2.1 | 44.85,33.77 45.85,34.77 | NMODULE.10 59.97,34.77 45.85,34.77 | R1.1 44.85,33.77 | REG1.3 41.16,27.34 41.16,27.19 v44.65,23.71 | v32.85,40.95 32.8,40.89 32.79,40.89 IC2.3 32.79,34.78 28.31,30.3 v23.18,30.3
  Bottom 0.508: v32.85,40.95 33.67,41.77 38.27,41.77 BOOST.1 39.03,41.67 44.2,36.51 44.91,36.51 F1.P$1 44.91,32.45 44.99,32.38 45.66,32.38 REG2.IN+ 44.48,31.2 44.48,30.65 41.16,27.34 REG1.3 | v44.65,23.71 45.81,22.55 45.81,17.43 48.52,14.72 HM1.1 | X3.2 X1.2 5.14,10.71 5.14,14.2 6.25,15.32 6.25,21.33 9.13,24.21 9.78,24.21 RAW.2 9.78,26.57 10.07,26.86 10.07,28.95 11.43,30.3 v23.18,30.3
VCC  (via drill 0.3 pad 0.61)
  Top 0.508: BH1750.1 60.82,46.2 58.6,43.99 49.28,43.99 46.84,46.44 REG2.OUT+ | D7.3 I2C..3 | BOOST.3 42.91,41.67 41.69,42.89 32.51,42.89 30.5,40.89 IC2.2 30.5,34.08 v30.47,34.05 C6.2 29.27,33.02 28,33.02 26.98,32 CC0.VCC 14.74,32 M1.J6.4 | 50.8,26.28 50.8,26.02 JP3.3 | 50.8,26.28 53.88,26.28 54.74,27.13 54.74,27.42 MOTION.1 57.02,27.42 58.38,28.78 61.47,28.78 63.5,26.75 NMODULE.8 | 50.8,26.28 JP3.4 HM3.2 | X3.6 21.56,3.29 I2C-1.1
  Bottom 0.508: 45.66,41.67 BOOST.3 | HM3.2 50.8,36.53 45.66,41.67 | 45.66,41.67 45.66,45.25 REG2.OUT+ | 44.24,24.72 43.96,24.44 43.96,19.62 44.45,19.13 I2C-2.1 43.31,17.99 43.31,17.74 39.56,14 38.16,14 35.64,11.48 35.64,10.04 | 29.04,2.66 29.53,3.15 29.53,5.52 | 29.04,2.66 29.63,2.66 29.63,1.55 30.25,0.92 32.21,0.92 33.13,1.85 33.13,9.63 33.54,10.04 35.64,10.04 | 29.04,2.66 C1.1 27.26,2.66 26.63,3.29 I2C-1.1 | I2C..3 57.15,9.01 | 57.15,9.01 | 57.15,9.01 C15.2 C30.1 | 44.24,24.72 44.4,24.88 OPT.3 JP3.3 JP3.2 JP3.1 | 46.99,9.01 A0.3 43.18,9.01 42.67,9.51 C16.2 C27.1 40.13,9.01 UART.3 36.2,9.01 36.2,9.48 35.64,10.04 | STEPUP.2 30.16,6.47 30.16,6.15 29.53,5.52 | STEPUP.4 29.53,5.52 | 21.61,20.44 22.55,21.37 C10.2 | 21.61,20.44 20.93,20.44 20.29,21.07 R5.1 18.73,21.16 16.4,23.49 16.4,26.6 15.69,27.32 13.9,27.32 | RS485.8 21.61,20.44 | 7.3,19.3 R3.1 | 13.9,27.32 13.9,23.18 10.02,19.3 7.3,19.3 | M1.J6.4 12.8,27.32 13.9,27.32 | R7.1 7.3,19.3 | C3.+ 31.14,33.75 30.77,33.75 v30.47,34.05 | 44.24,24.72 42.66,26.3 REG1.1 | X3.6 X1.6 | 46.99,9.01 | 46.99,9.01 C29.1 C28.1 49.66,9.01 D7.3
VIN
  Bottom 0.305: L1.1 27.3,7.87 27.67,7.5 27.67,7.41 STEPUP.6 28.82,7.41 | 28.82,7.41 STEPUP.1 | 28.82,7.41 28.82,8.51 C5.1

### Text on the board
tPlace: Inclusion | easyMySens V0.99 | by Ranseyer | HM | uni- / versal
tOrigins: G3 | G1 | G1 | G3 | G2 | G1 | G1 | G3 | G3 | Gehäuse 1: Box2252 / Geh2: 59x65 / Gehäuse 3: 67x98
tNames: + | - | IN | - | OUT | - | AMS1117 | SDA | MISO | C4 | C2 | Antenna | ATSHA204A / (MySensors / optional) | SCK | MOSI | 22p | 470K | 100nF | 1M | CC1101 / for / HM | GND | C6 | - | VCC | VCC | R2 | R1 | Mini360 | + | - | UREG | VCC | VCC | + | V+ | IRQ | - | MISO | Reg1 | VCC | - | MOSI | SCK | - | D4 | CSN | CE /D9 | + | A5 | GND | - | VCC | UREG | SCL | SDA | - | + | GND | GND | GND | - | - | - | - | A2 | SCL | + | VCC | + | VCC | + | VCC | + | IN | A | A1 | TX | A1 | D5 | A4 | A2 | RX | D6 | A5 | UREG | B | GND | VCC | I2C | VCC GND A4/SDA SCL | UART | Analog | Digital | I2C
bNames: - | + | RST | OUT | DIO0 | NSS | MOSI | MISO | SCK | GND | 150R | Antenna | VCC | Fuse1 | C3 10uF | - | IN | + | Mini360 | - | + | R5/6 | 22p | Max487 | 330R | 330R | C1 10uF | Grove Connectors
Milling: Please include the cutouts...